# EAGLE design RobotBoard_v2.0 (EAGLE 6.1)
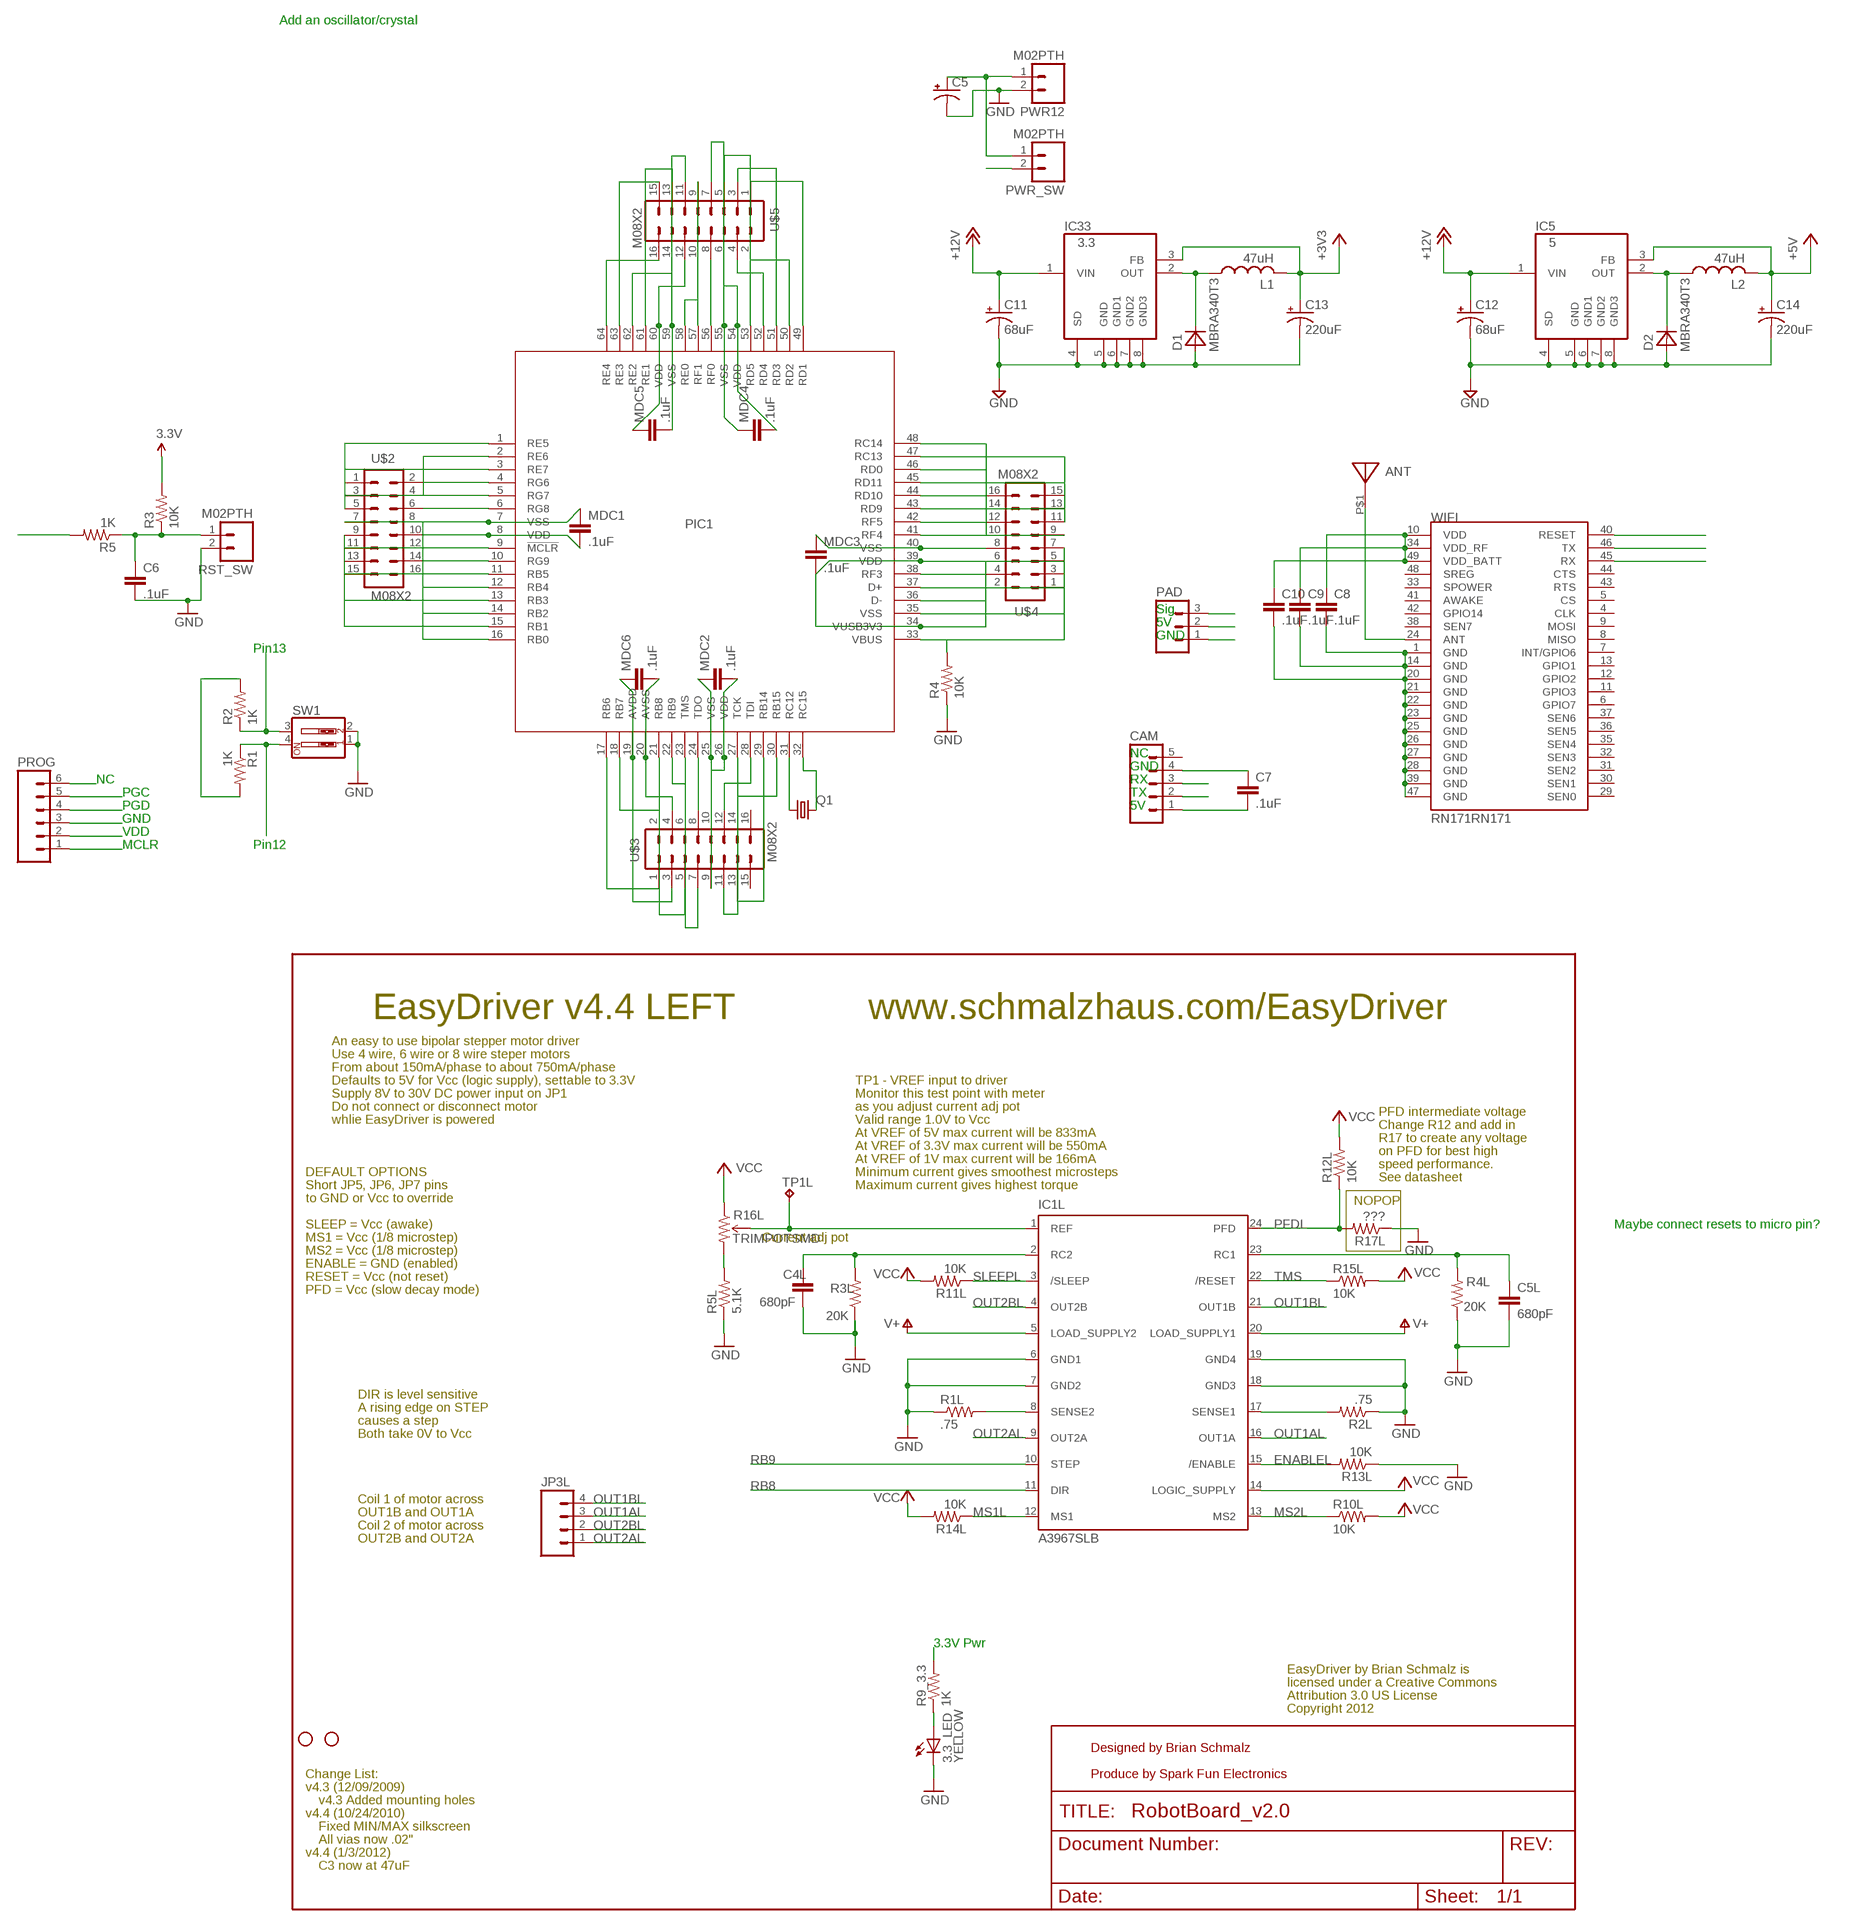
[diagram p0: schematic, sheet 1, part 1 of 2]
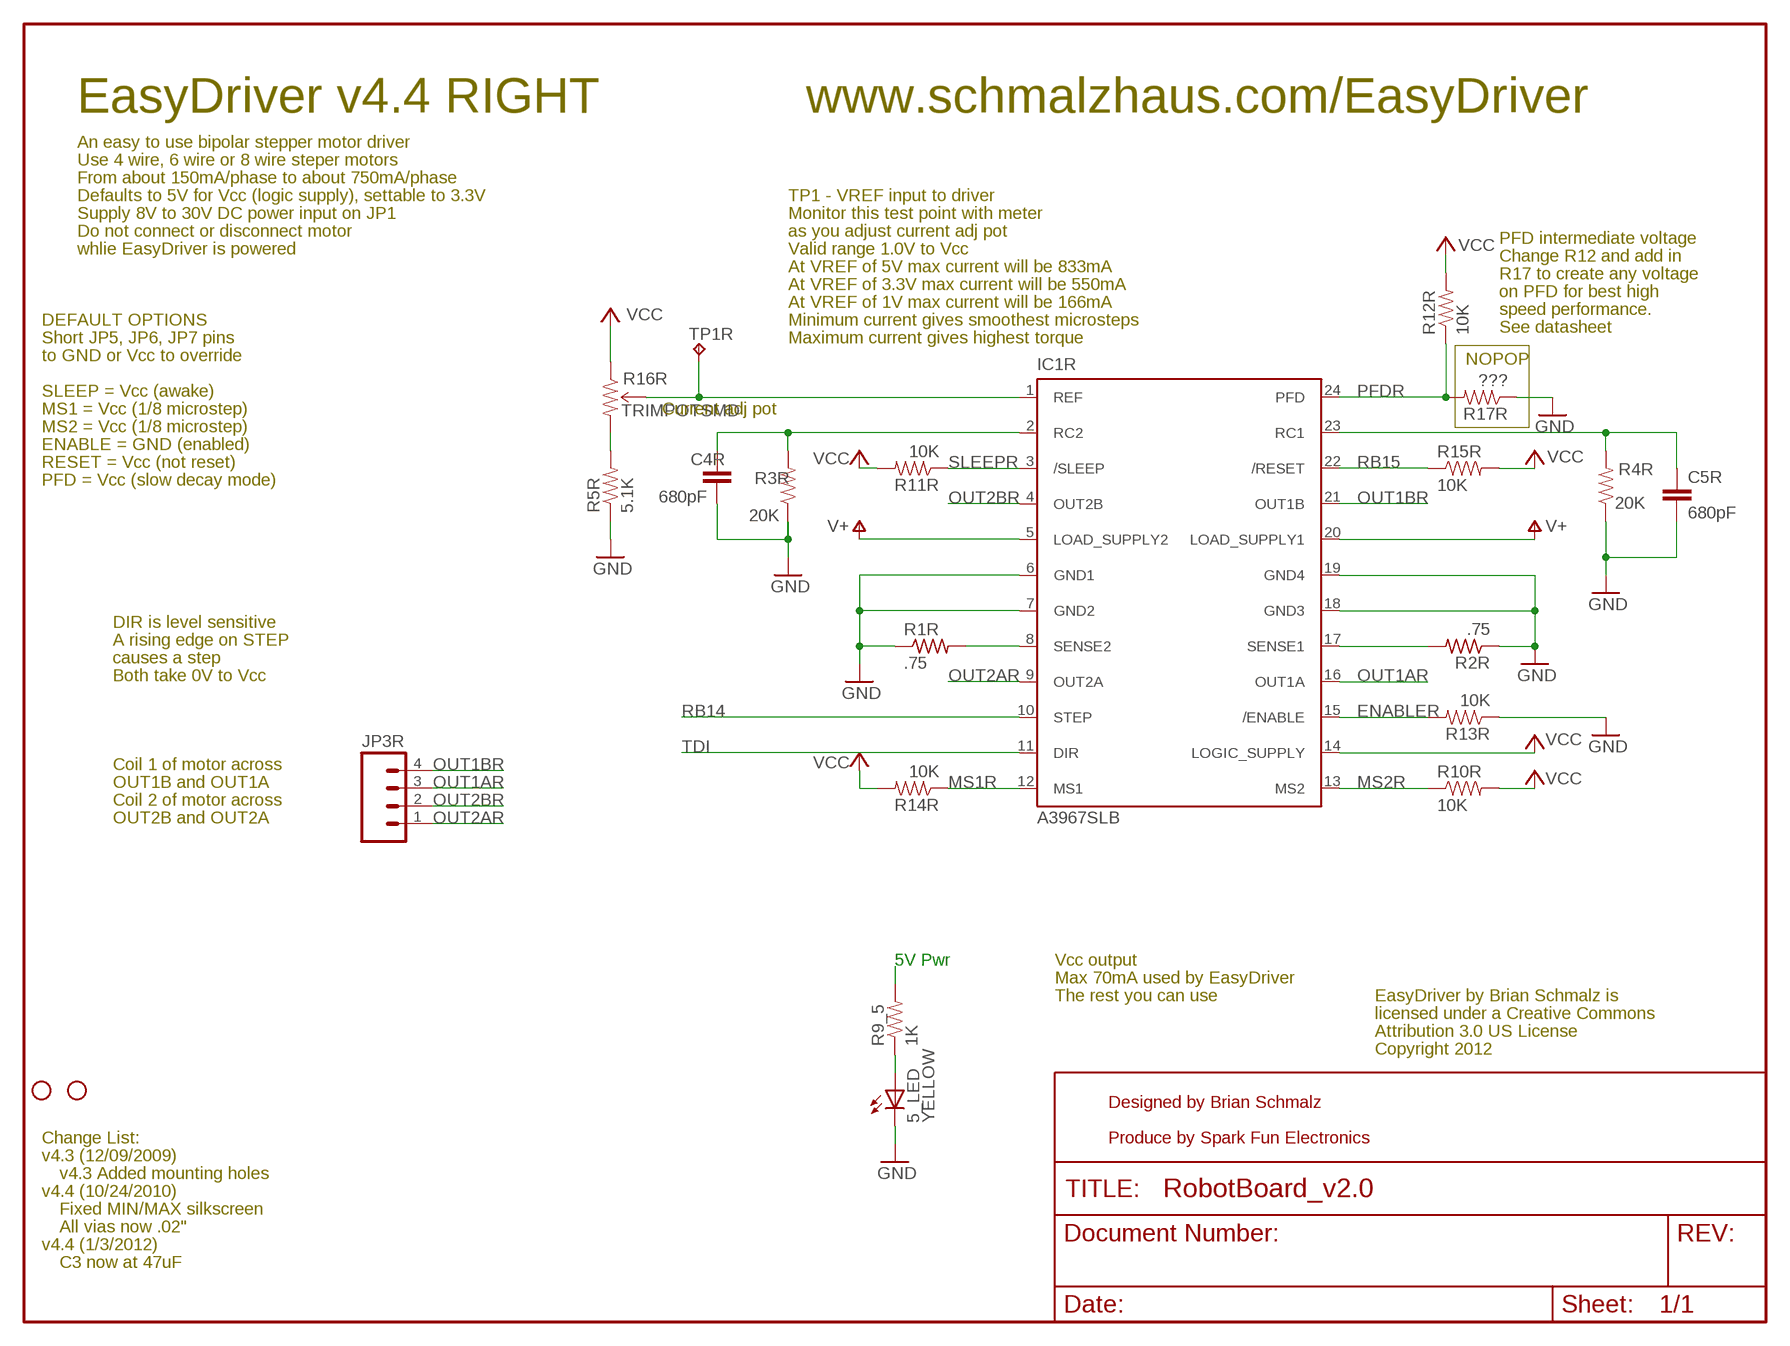
[diagram p1: schematic, sheet 1, part 2 of 2]

## Parts
3.3_LED  YELLOW  LED0603  [LED-0603]
5_LED  YELLOW  LED0603  [LED-0603]
ANT  2450AT18A100  [2450AT18A100]
C4L  680pF  CAP0402  [C0402]
C4R  680pF  CAP0402  [C0402]
C5  CAP_POLPTH4  [CPOL-RADIAL-1000UF-25V]
C5L  680pF  CAP0402  [C0402]
C5R  680pF  CAP0402  [C0402]
C6  .1uF  CAP0603  [0603]
C7  .1uF  CAP0603  [0603]
C8  .1uF  CAP0603  [0603]
C9  .1uF  CAP0603  [0603]
C10  .1uF  CAP0603  [0603]
C11  68uF  CPOL-USD  [PANASONIC_D]
C12  68uF  CPOL-USD  [PANASONIC_D]
C13  220uF  CPOL-USD  [PANASONIC_D]
C14  220uF  CPOL-USD  [PANASONIC_D]
CAM  M05LOCK  [1X05_LOCK]
D1  MBRA340T3  [SMA]
D2  MBRA340T3  [SMA]
IC1L  A3967SLB  [SO24W]
IC1R  A3967SLB  [SO24W]
IC5  5  AP1509  [SO08]
IC33  3.3  AP1509  [SO08]
JP1  STAND-OFF  [STAND-OFF]
JP2  STAND-OFF  [STAND-OFF]
JP3L  M041X04_NO_SILK  [1X04_NO_SILK]
JP3R  M041X04_NO_SILK  [1X04_NO_SILK]
JP8  STAND-OFF  [STAND-OFF]
JP9  STAND-OFF  [STAND-OFF]
L1  47uH  L-US6000-XXX-RC  [6000-XXXX-RC]
L2  47uH  L-US6000-XXX-RC  [6000-XXXX-RC]
MDC1  .1uF  CAP0603  [0603]
MDC2  .1uF  CAP0603  [0603]
MDC3  .1uF  CAP0603  [0603]
MDC4  .1uF  CAP0603  [0603]
MDC5  .1uF  CAP0603  [0603]
MDC6  .1uF  CAP0603  [0603]
PAD  M03POLAR  [MOLEX-1X3]
PIC1  PIC32MZ2048ECM064  [TQFP64-10X10X1MM]
PROG  M06LOCK  [1X06_LOCK]
PWR12  M02PTH  [1X02]
PWR_SW  M02PTH  [1X02]
Q1  CRYSTALHC49UP  [HC49UP]
R1  1K  RESISTOR0402  [C0402]
R1L  .75  R-US_R0805  [R0805]
R1R  .75  R-US_R0805  [R0805]
R2  1K  RESISTOR0402  [C0402]
R2L  .75  R-US_R0805  [R0805]
R2R  .75  R-US_R0805  [R0805]
R3  10K  RESISTOR0402  [C0402]
R3L  20K  RESISTOR0402  [C0402]
R3R  20K  RESISTOR0402  [C0402]
R4  10K  RESISTOR0402  [C0402]
R4L  20K  RESISTOR0402  [C0402]
R4R  20K  RESISTOR0402  [C0402]
R5  1K  RESISTOR0402  [C0402]
R5L  5.1K  RESISTOR0402  [C0402]
R5R  5.1K  RESISTOR0402  [C0402]
R9_3.3  1K  RESISTOR0402  [C0402]
R9_5  1K  RESISTOR0402  [C0402]
R10L  10K  RESISTOR0402  [C0402]
R10R  10K  RESISTOR0402  [C0402]
R11L  10K  RESISTOR0402  [C0402]
R11R  10K  RESISTOR0402  [C0402]
R12L  10K  RESISTOR0402  [C0402]
R12R  10K  RESISTOR0402  [C0402]
R13L  10K  RESISTOR0402  [C0402]
R13R  10K  RESISTOR0402  [C0402]
R14L  10K  RESISTOR0402  [C0402]
R14R  10K  RESISTOR0402  [C0402]
R15L  10K  RESISTOR0402  [C0402]
R15R  10K  RESISTOR0402  [C0402]
R16L  TRIMPOTSMD  [TRIMPOT-3MM]
R16R  TRIMPOTSMD  [TRIMPOT-3MM]
R17L  ???  RESISTOR0402  [C0402]
R17R  ???  RESISTOR0402  [C0402]
RST_SW  M02PTH  [1X02]
SW1  SW_DIP-2  [DIPSWITCH-02]
TP1L  TPPAD1-13  [P1-13]
TP1R  TPPAD1-13  [P1-13]
U$2  M08X2  [2X8]
U$3  M08X2  [2X8]
U$4  M08X2  [2X8]
U$5  M08X2  [2X8]
WIFI  RN171RN171  [RN171]

## Nets
3.3V: C8.1 C9.1 C10.1 C13.+ IC1L.14(LOGIC_SUPPLY) IC1R.14(LOGIC_SUPPLY) IC33.3(FB) L1.2 MDC1.2 MDC2.2 MDC3.2 MDC4.2 MDC5.1 MDC6.1 PIC1.8(VDD) PIC1.19(AVDD) PIC1.26(VDD) PIC1.34(VUSB3V3) PIC1.39(VDD) PIC1.54(VDD) PIC1.60(VDD) PROG.2 R1.2 R2.2 R3.2 R9_3.3.2 R10L.2 R10R.2 R11L.2 R11R.2 R12L.2 R12R.2 R14L.2 R14R.2 R15L.2 R15R.2 R16L.1(CCW) R16R.1(CCW) U$2.8 U$3.3 U$3.10 U$4.2 U$4.7 U$5.6 U$5.12 WIFI.10(VDD) WIFI.34(VDD_RF) WIFI.49(VDD_BATT) ; supply symbol labelled VCC, +3V3
5V: C7.2 C14.+ CAM.1 IC5.3(FB) L2.2 PAD.2 R9_5.2 ; supply symbol labelled +5V
12V: C11.+ C12.+ IC1L.5(LOAD_SUPPLY2) IC1L.20(LOAD_SUPPLY1) IC1R.5(LOAD_SUPPLY2) IC1R.20(LOAD_SUPPLY1) IC5.1(VIN) IC33.1(VIN) PWR_SW.2 ; supply symbol labelled V+, +12V
!MCLR: PIC1.9(!MCLR) PROG.1 R5.2 U$2.9
A44: C6.1 R3.1 R5.1 RST_SW.1
D+: PIC1.37(D+) U$4.5
D-: PIC1.36(D-) U$4.4
ENABLEL: IC1L.15(/ENABLE) R13L.2
ENABLER: IC1R.15(/ENABLE) R13R.2
GND: 3.3_LED.C 5_LED.C C4L.2 C4R.2 C5.2(-) C5L.2 C5R.2 C6.2 C7.1 C8.2 C9.2 C10.2 C11.- C12.- C13.- C14.- CAM.4 D1.A D2.A IC1L.6(GND1) IC1L.7(GND2) IC1L.18(GND3) IC1L.19(GND4) IC1R.6(GND1) IC1R.7(GND2) IC1R.18(GND3) IC1R.19(GND4) IC5.4(SD) IC5.5(GND) IC5.6(GND1) IC5.7(GND2) IC5.8(GND3) IC33.4(SD) IC33.5(GND) IC33.6(GND1) IC33.7(GND2) IC33.8(GND3) MDC1.1 MDC2.1 MDC3.1 MDC4.1 MDC5.2 MDC6.2 PAD.1 PIC1.7(VSS) PIC1.20(AVSS) PIC1.25(VSS) PIC1.35(VSS) PIC1.40(VSS) PIC1.55(VSS) PIC1.59(VSS) PROG.3 PWR12.2 R1L.1 R1R.1 R2L.1 R2R.1 R3L.1 R3R.1 R4.1 R4L.1 R4R.1 R5L.1 R5R.1 R13L.1 R13R.1 R17L.1 R17R.1 RST_SW.2 SW1.1 SW1.2 U$2.7 U$3.4 U$3.9 U$4.3 U$4.8 U$5.7 U$5.11 WIFI.1(GND) WIFI.14(GND) WIFI.20(GND) WIFI.21(GND) WIFI.22(GND) WIFI.23(GND) WIFI.25(GND) WIFI.26(GND) WIFI.27(GND) WIFI.28(GND) WIFI.39(GND) WIFI.47(GND)
MS1L: IC1L.12(MS1) R14L.1
MS1R: IC1R.12(MS1) R14R.1
MS2L: IC1L.13(MS2) R10L.1
MS2R: IC1R.13(MS2) R10R.1
N$1: IC1L.8(SENSE2) R1L.2
N$2: 3.3_LED.A R9_3.3.1
N$3: IC1L.17(SENSE1) R2L.2
N$5: C4L.1 IC1L.2(RC2) R3L.2
N$6: PIC1.31(RC12) Q1.1
N$7: C5L.1 IC1L.23(RC1) R4L.2
N$8: IC1R.8(SENSE2) R1R.2
N$9: IC1R.17(SENSE1) R2R.2
N$10: C4R.1 IC1R.2(RC2) R3R.2
N$11: R5L.2 R16L.3(CW)
N$12: IC1L.1(REF) R16L.2(WIPER) TP1L.1(TP)
N$13: C5R.1 IC1R.23(RC1) R4R.2
N$14: IC1R.1(REF) R16R.2(WIPER) TP1R.1(TP)
N$15: PIC1.32(RC15) Q1.2
N$16: R5R.2 R16R.3(CW)
N$17: 5_LED.A R9_5.1
N$18: ANT.P$1 WIFI.24(ANT)
N$19: C5.1(+) PWR12.1 PWR_SW.1
N$34: PROG.6
N$40: D1.C IC33.2(OUT) L1.1
N$45: D2.C IC5.2(OUT) L2.1
OUT1AL: IC1L.16(OUT1A) JP3L.3
OUT1AR: IC1R.16(OUT1A) JP3R.3
OUT1BL: IC1L.21(OUT1B) JP3L.4
OUT1BR: IC1R.21(OUT1B) JP3R.4
OUT2AL: IC1L.9(OUT2A) JP3L.1
OUT2AR: IC1R.9(OUT2A) JP3R.1
OUT2BL: IC1L.4(OUT2B) JP3L.2
OUT2BR: IC1R.4(OUT2B) JP3R.2
PFDL: IC1L.24(PFD) R12L.1 R17L.2
PFDR: IC1R.24(PFD) R12R.1 R17R.2
RB0: PIC1.16(RB0) PROG.4 U$2.16
RB1: PIC1.15(RB1) PROG.5 U$2.15
RB2: PIC1.14(RB2) U$2.14
RB3: PIC1.13(RB3) R2.1 SW1.3 U$2.13
RB4: PIC1.12(RB4) R1.1 SW1.4 U$2.12
RB5: PIC1.11(RB5) U$2.11
RB6: PIC1.17(RB6) U$3.1
RB7: PIC1.18(RB7) U$3.2
RB8: IC1L.11(DIR) PIC1.21(RB8) U$3.5
RB9: IC1L.10(STEP) PIC1.22(RB9) U$3.6
RB14: IC1R.10(STEP) PIC1.29(RB14) U$3.13
RB15: IC1R.22(/RESET) PIC1.30(RB15) R15R.1 U$3.14
RC13: PIC1.47(RC13) U$4.15
RC14: PIC1.48(RC14) U$4.16
RD0: CAM.3 PIC1.46(RD0) U$4.14
RD1: PIC1.49(RD1) U$5.1
RD2: PIC1.50(RD2) U$5.2
RD3: PIC1.51(RD3) U$5.3
RD4: PIC1.52(RD4) U$5.4
RD5: PIC1.53(RD5) U$5.5
RD9: CAM.2 PIC1.43(RD9) U$4.11
RD10: PIC1.44(RD10) U$4.12
RD11: PIC1.45(RD11) U$4.13
RE0: PIC1.58(RE0) U$5.10
RE1: PIC1.61(RE1) U$5.13
RE2: PIC1.62(RE2) U$5.14
RE3: PIC1.63(RE3) U$5.15
RE4: PIC1.64(RE4) U$5.16
RE5: PIC1.1(RE5) U$2.1
RE6: PIC1.2(RE6) U$2.2
RE7: PIC1.3(RE7) U$2.3
RF0: PIC1.56(RF0) U$5.8
RF1: PIC1.57(RF1) U$5.9
RF3: PAD.3 PIC1.38(RF3) U$4.6
RF4: PIC1.41(RF4) U$4.9
RF5: PIC1.42(RF5) U$4.10
RG6: PIC1.4(RG6) U$2.4 WIFI.40(RESET)
RG7: PIC1.5(RG7) U$2.5 WIFI.45(RX)
RG8: PIC1.6(RG8) U$2.6 WIFI.46(TX)
RG9: PIC1.10(RG9) U$2.10
SLEEPL: IC1L.3(/SLEEP) R11L.1
SLEEPR: IC1R.3(/SLEEP) R11R.1
TCK: PIC1.27(TCK) U$3.11
TDD: PIC1.24(TDO) U$3.8
TDI: IC1R.11(DIR) PIC1.28(TDI) U$3.12
TMS: IC1L.22(/RESET) PIC1.23(TMS) R15L.1 U$3.7
VBUS: PIC1.33(VBUS) R4.2 U$4.1
Unconnected: CAM.5 U$3.15 U$3.16 WIFI.4(CLK) WIFI.5(CS) WIFI.6(GPIO7) WIFI.7(INT/GPIO6) WIFI.8(MISO) WIFI.9(MOSI) WIFI.11(GPIO3) WIFI.12(GPIO2) WIFI.13(GPIO1) WIFI.29(SEN0) WIFI.30(SEN1) WIFI.31(SEN2) WIFI.32(SEN3) WIFI.33(SPOWER) WIFI.35(SEN4) WIFI.36(SEN5) WIFI.37(SEN6) WIFI.38(SEN7) WIFI.41(AWAKE) WIFI.42(GPIO14) WIFI.43(RTS) WIFI.44(CTS) WIFI.48(SREG)

## Notes on the sheet
- Add an oscillator/crystal
- Sig
- 5V
- GND
- Pin13
- NC
- GND
- NC | RX
- PGC | TX
- PGD | 5V
- GND
- VDD
- MCLR | Pin12
- EasyDriver v4.4 LEFT | www.schmalzhaus.com/EasyDriver
- An easy to use bipolar stepper motor driver
- Use 4 wire, 6 wire or 8 wire steper motors
- From about 150mA/phase to about 750mA/phase
- Defaults to 5V for Vcc (logic supply), settable to 3.3V | TP1 - VREF input to driver
- Supply 8V to 30V DC power input on JP1 | Monitor this test point with meter
- Do not connect or disconnect motor | as you adjust current adj pot
- PFD intermediate voltage
- whlie EasyDriver is powered | Valid range 1.0V to Vcc
- Change R12 and add in
- At VREF of 5V max current will be 833mA
- R17 to create any voltage
- At VREF of 3.3V max current will be 550mA
- on PFD for best high
- At VREF of 1V max current will be 166mA
- speed performance.
- DEFAULT OPTIONS | Minimum current gives smoothest microsteps
- See datasheet
- Short JP5, JP6, JP7 pins | Maximum current gives highest torque
- to GND or Vcc to override | NOPOP
- SLEEP = Vcc (awake) | Maybe connect resets to micro pin?
- MS1 = Vcc (1/8 microstep) | Current adj pot
- MS2 = Vcc (1/8 microstep)
- ENABLE = GND (enabled)
- RESET = Vcc (not reset)
- PFD = Vcc (slow decay mode)
- DIR is level sensitive
- A rising edge on STEP
- causes a step
- Both take 0V to Vcc
- Coil 1 of motor across
- OUT1B and OUT1A
- Coil 2 of motor across
- OUT2B and OUT2A
- 3.3V Pwr
- EasyDriver by Brian Schmalz is
- licensed under a Creative Commons
- Attribution 3.0 US License
- Copyright 2012
- Designed by Brian Schmalz
- Change List: | Produce by Spark Fun Electronics
- v4.3 (12/09/2009)
- v4.3 Added mounting holes
- v4.4 (10/24/2010)
- Fixed MIN/MAX silkscreen
- All vias now .02"
- v4.4 (1/3/2012)
- C3 now at 47uF
- EasyDriver v4.4 RIGHT | www.schmalzhaus.com/EasyDriver
- An easy to use bipolar stepper motor driver
- Use 4 wire, 6 wire or 8 wire steper motors
- From about 150mA/phase to about 750mA/phase
- Defaults to 5V for Vcc (logic supply), settable to 3.3V | TP1 - VREF input to driver
- Supply 8V to 30V DC power input on JP1 | Monitor this test point with meter
- Do not connect or disconnect motor | as you adjust current adj pot
- PFD intermediate voltage
- whlie EasyDriver is powered | Valid range 1.0V to Vcc
- Change R12 and add in
- At VREF of 5V max current will be 833mA
- R17 to create any voltage
- At VREF of 3.3V max current will be 550mA
- on PFD for best high
- At VREF of 1V max current will be 166mA
- speed performance.
- DEFAULT OPTIONS | Minimum current gives smoothest microsteps
- See datasheet
- Short JP5, JP6, JP7 pins | Maximum current gives highest torque
- to GND or Vcc to override | NOPOP
- SLEEP = Vcc (awake)
- MS1 = Vcc (1/8 microstep) | Current adj pot
- MS2 = Vcc (1/8 microstep)
- ENABLE = GND (enabled)
- RESET = Vcc (not reset)
- PFD = Vcc (slow decay mode)
- DIR is level sensitive
- A rising edge on STEP
- causes a step
- Both take 0V to Vcc
- Coil 1 of motor across
- OUT1B and OUT1A
- Coil 2 of motor across
- OUT2B and OUT2A
- 5V Pwr | Vcc output
- Max 70mA used by EasyDriver
- The rest you can use | EasyDriver by Brian Schmalz is
- licensed under a Creative Commons
- Attribution 3.0 US License
- Copyright 2012
- Designed by Brian Schmalz
- Change List: | Produce by Spark Fun Electronics
- v4.3 (12/09/2009)
- v4.3 Added mounting holes
- v4.4 (10/24/2010)
- Fixed MIN/MAX silkscreen
- All vias now .02"
- v4.4 (1/3/2012)
- C3 now at 47uF

## Library data of the parts
3.3_LED 5_LED = SparkFun03_30_09:LED: LEDs Standard schematic elements and footprints for 5mm, 3mm, 1206, and 0603 sized LEDs. 5mm - Spark Fun Electronics SKU : COM-00529 (and others)
ANT = Johanson_antenna:2450AT18A100
C4L C4R C5L C5R = SparkFun03_30_09:CAP: Capacitor Standard 0603 ceramic capacitor, and 0.1" leaded capacitor.
C5 = SparkFun-Capacitors:CAP_POL: Capacitor Polarized These are standard SMD and PTH capacitors. Normally 10uF, 47uF, and 100uF in electrolytic and tantalum varieties. Always verify the external diameter of the through hole cap, it varies with capacity, voltage, and manufacturer. The EIA devices should be standard.
C6-C10 MDC1-MDC6 = SparkFun-2-11-09:CAP: Capacitor Standard 0603 ceramic capacitor, and 0.1" leaded capacitor.
C11-C14 = rcl:CPOL-US: POLARIZED CAPACITOR, American symbol
CAM = SparkFun-Connectors:M05: Header 5 Standard 5-pin 0.1" header. Use with straight break away headers (SKU : PRT-00116), right angle break away headers (PRT-00553), swiss pins (PRT-00743), machine pins (PRT-00117), and female headers (PRT-00115). Molex polarized connector foot print use with SKU : PRT-08230 with associated crimp pins and housings.
D1 D2 = diode:MBRA340T3: Surface Mount Schottky Power Rectifier Source: http://www.onsemi.com/pub_link/Collateral/MBRA340T3-D.PDF
IC1L IC1R = Allegro:A3967SLB: ANALOG DEVICES
IC5 IC33 = crw:AP1509: 150KHz, 2A PWM BUCK DC/DC CONVERTER; OC_FARNELL: unknown; OC_NEWARK: unknown
JP1 JP2 JP8 JP9 = SparkFun-7-28-09:STAND-OFF: Stand Off This is the mechanical footprint for a #4 phillips button head screw. Use the keepout ring to avoid running the screw head into surrounding components. SKU : PRT-00447
JP3L JP3R = SparkFun:M04: Header 4 Standard 4-pin 0.1" header. Use with straight break away headers (SKU : PRT-00116), right angle break away headers (PRT-00553), swiss pins (PRT-00743), machine pins (PRT-00117), and female headers (PRT-00115). Molex polarized connector foot print use with SKU : PRT-08231 with associated crimp pins and housings.
L1 L2 = rcl:L-US: INDUCTOR, American symbol
PAD = SparkFun-Connectors:M03: Header 3 Standard 3-pin 0.1" header. Use with straight break away headers (SKU : PRT-00116), right angle break away headers (PRT-00553), swiss pins (PRT-00743), machine pins (PRT-00117), and female headers (PRT-00115). Molex polarized connector foot print use with SKU : PRT-08232 with associated crimp pins and housings.
PIC1 = microchip:PIC32MZ2048ECM064: PIC32MZ2048ECM064 Microchip microcontroller TQFP64 10x10x1
PROG = SparkFun-Connectors:M06: Header 6 Standard 6-pin 0.1" header. Use with straight break away headers (SKU : PRT-00116), right angle break away headers (PRT-00553), swiss pins (PRT-00743), machine pins (PRT-00117), and female headers (PRT-00115). Molex polarized connector foot print use with SKU : PRT-08094 with associated crimp pins and housings. NOTES ON THE VARIANTS LOCK and LOCK_LONGPADS... This footprint was designed to help hold the alignment of a through-hole component (i.e. 6-pin header) while soldering it into place. You may notice that each hole has been shifted either up or down by 0.005 of an inch from it's more standard position (which is a perfectly straight line). This slight alteration caused the pins (the squares in the middle) to touch the edges of the holes. Because they are alternating, it causes a "brace" to hold the component in place. 0.005 has proven to be the perfect amount of "off-center" position when using our standard breakaway headers. Although looks a little odd when you look at the bare footprint, once you have a header in there, the alteration is very hard to notice. Also,if you push a header all the way into place, it is covered up entirely on the bottom side. This idea of altering the position of holes to aid alignment will be further integrated into the Sparkfun Library for other footprints. It can help hold any component with 3 or more connection pins.
PWR12 PWR_SW RST_SW = SparkFun-Connectors:M02: Standard 2-pin 0.1" header. Use with - straight break away headers ( PRT-00116) - right angle break away headers (PRT-00553) - swiss pins (PRT-00743) - machine pins (PRT-00117) - female headers (PRT-00115) Molex polarized connector foot print use with: PRT-08233 with associated crimp pins and housings. 2.54_SCREWTERM for use with PRT-10571. 3.5mm Screw Terminal footprints for PRT-08084 5mm Screw Terminal footprints for use with PRT-08433
Q1 = crystal:CRYSTAL: CRYSTAL; OC_FARNELL: unknown; OC_NEWARK: unknown
R1-R3 R3L R3R R4 R4L R4R R5 R5L R5R R9_3.3 R9_5 R10L R10R R11L R11R R12L R12R R13L R13R R14L R14R R15L R15R R17L R17R = SparkFun03_30_09:RESISTOR: Resistor Basic schematic elements and footprints for 0603, 1206, and PTH 1/10th watt (small) resistors.
R1L R1R R2L R2R = rcl:R-US_: RESISTOR, American symbol
R16L R16R = SparkFun:TRIMPOT
SW1 = SparkFun-Electromechanical:SW_DIP-2: DIP SWITCH
TP1L TP1R = testpad:TP
U$2-U$5 = SparkFun-Connectors:M08X2: .1" headers, two rows of 8 each
WIFI = SparkFun-RF:RN171: WiFi Module

## Board
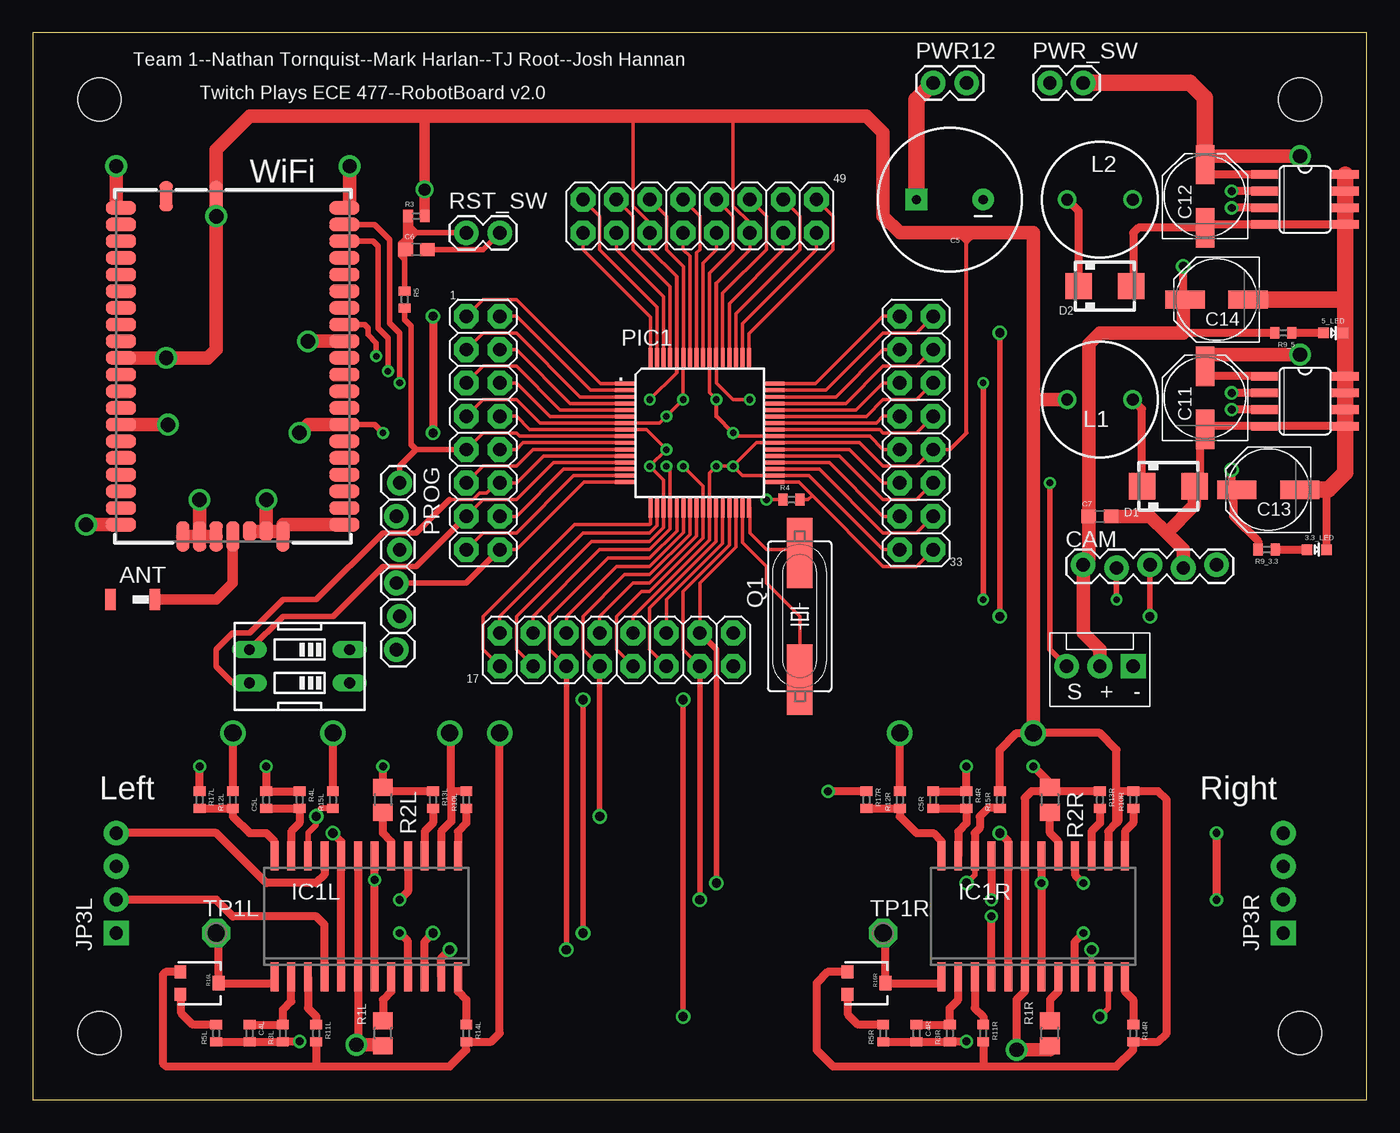
[diagram p2: board, top side]
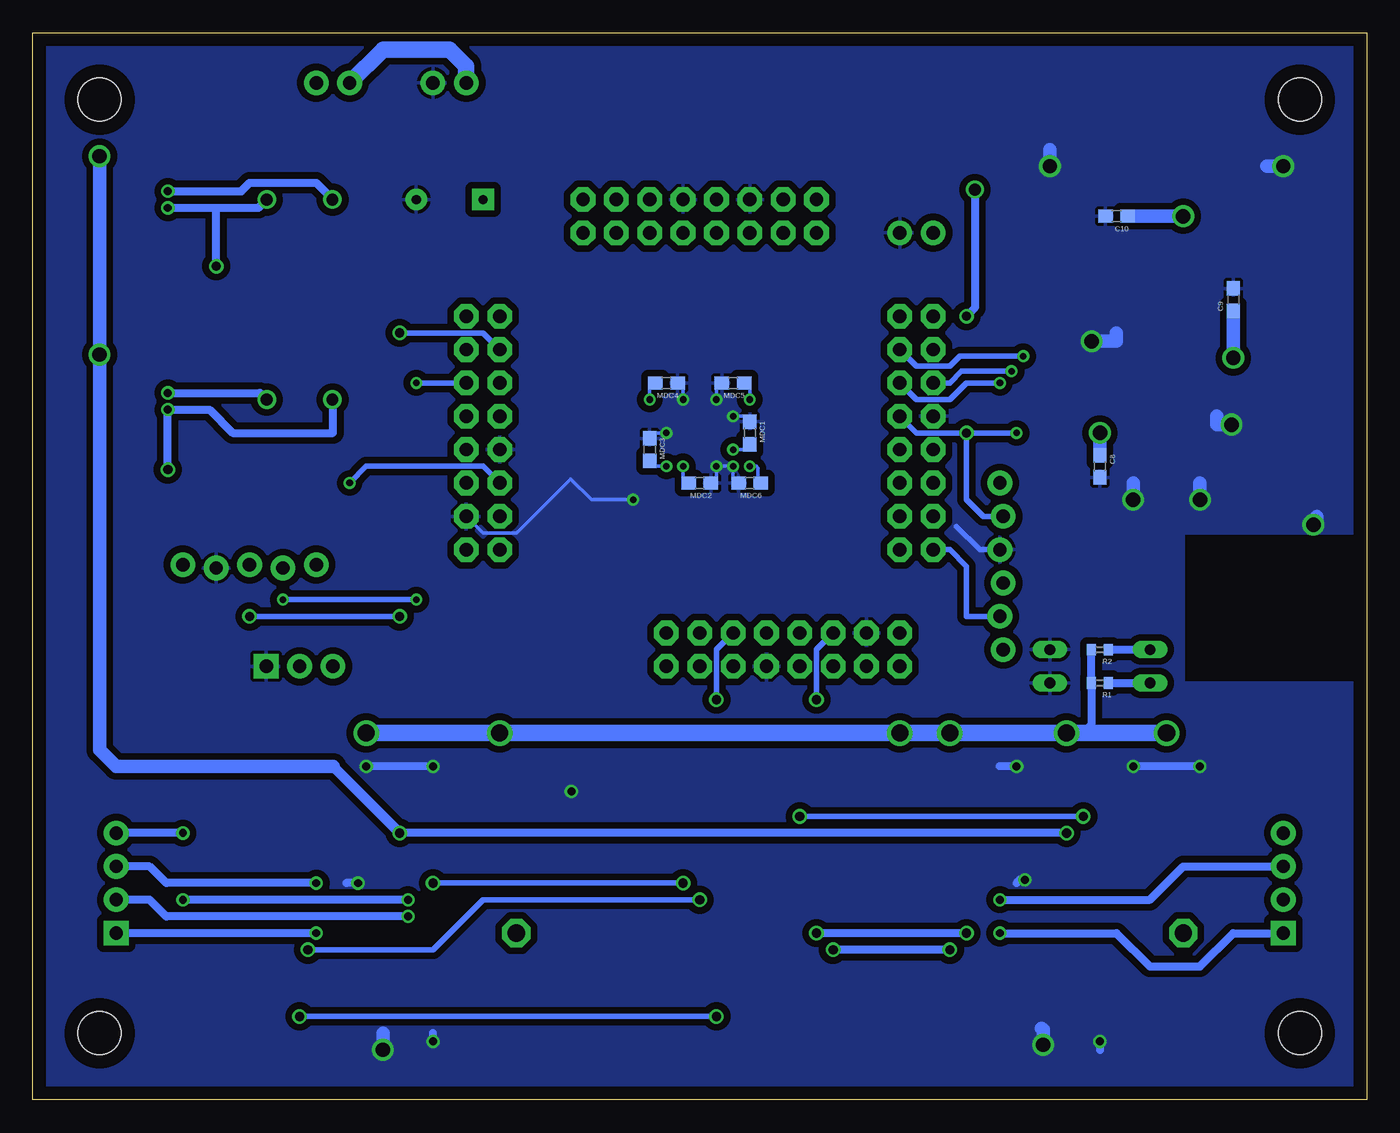
[diagram p3: board, bottom side, seen from below]

Size 101.6 x 81.28 mm. Coordinates in mm from the lower left corner, seen from the top.
Outline: 0,0 101.6,0 101.6,81.28 0,81.28 0,0
Copper layers (1*16): Top 0.035mm / dielectric 1.5mm / Bottom 0.035mm
Design rules: minimum track width 10mil, minimum drill 24mil, track to track 8mil, track to pad 8mil, pad to pad 8mil, via to via 8mil, smd to smd 8mil, copper to edge 40mil, drill to drill 8mil, minimum pad ring 10mil, minimum via ring 8mil, stop-mask expansion 4mil, vias tented up to drill 0mil, thermal gap 10mil
tKeepout: area 0,33 to 12.7,41.9
bKeepout: area 0,31.8 to 14,43.2

### Footprints (pad centres in the part's own frame; a part is rotated, then mirrored left to right if it is on the bottom)
LED-0603 = smd 0.8 x 0.8: A 0,-0.75; C 0,0.75
2450AT18A100 = smd 0.8 x 1.6: P$1 -1.7,0; P$2 1.7,0
C0402 = smd 0.7 x 0.9: 1 -0.65,0; 2 0.65,0
CPOL-RADIAL-1000UF-25V = drill 0.7 pad 1.651 square: 1 2.54,0 | drill 0.7 pad 1.651: 2 -2.54,0
0603 = smd 1.1 x 1: 1 -0.85,0; 2 0.85,0
PANASONIC_D = smd 3 x 1.4: + 2.4,0; - -2.4,0
1X05_LOCK = drill 1.016 pad 1.88: 1 0,0.127; 2 2.54,-0.127; 3 5.08,0.127; 4 7.62,-0.127; 5 10.16,0.127
SMA = smd 2 x 2: A 2,0; C -2,0
SO24W = smd 0.6 x 2.2: 1 -6.985,-4.6; 2 -5.715,-4.6; 3 -4.445,-4.6; 4 -3.175,-4.6; 5 -1.905,-4.6; 6 -0.635,-4.6; 7 0.635,-4.6; 8 1.905,-4.6; 9 3.175,-4.6; 10 4.445,-4.6; 11 5.715,-4.6; 12 6.985,-4.6; 13 6.985,4.6; 14 5.715,4.6; 15 4.445,4.6; 16 3.175,4.6; 17 1.905,4.6; 18 0.635,4.6; 19 -0.635,4.6; 20 -1.905,4.6; 21 -3.175,4.6; 22 -4.445,4.6; 23 -5.715,4.6; 24 -6.985,4.6
SO08 = smd 0.66 x 2.032: 1 -1.905,-3.073; 2 -0.635,-3.073; 3 0.635,-3.073; 4 1.905,-3.073; 5 1.905,3.073; 6 0.635,3.073; 7 -0.635,3.073; 8 -1.905,3.073
STAND-OFF = hole 3.302: 0,0
1X04_NO_SILK = drill 1.016 pad 1.88 square: 1 0,0 | drill 1.016 pad 1.88: 2 2.54,0; 3 5.08,0; 4 7.62,0
6000-XXXX-RC = drill 0.9 pad 1.422: 1 -2.5,0; 2 2.5,0
MOLEX-1X3 = drill 1.016 pad 1.88 square: 1 0,0 | drill 1.016 pad 1.88: 2 2.54,0; 3 5.08,0
TQFP64-10X10X1MM = smd 1.5 x 0.3: 1 -5.7,3.75; 2 -5.7,3.25; 3 -5.7,2.75; 4 -5.7,2.25; 5 -5.7,1.75; 6 -5.7,1.25; 7 -5.7,0.75; 8 -5.7,0.25; 9 -5.7,-0.25; 10 -5.7,-0.75; 11 -5.7,-1.25; 12 -5.7,-1.75; 13 -5.7,-2.25; 14 -5.7,-2.75; 15 -5.7,-3.25; 16 -5.7,-3.75; 33 5.7,-3.75; 34 5.7,-3.25; 35 5.7,-2.75; 36 5.7,-2.25; 37 5.7,-1.75; 38 5.7,-1.25; 39 5.7,-0.75; 40 5.7,-0.25; 41 5.7,0.25; 42 5.7,0.75; 43 5.7,1.25; 44 5.7,1.75; 45 5.7,2.25; 46 5.7,2.75; 47 5.7,3.25; 48 5.7,3.75 | smd 0.3 x 1.5: 17 -3.75,-5.7; 18 -3.25,-5.7; 19 -2.75,-5.7; 20 -2.25,-5.7; 21 -1.75,-5.7; 22 -1.25,-5.7; 23 -0.75,-5.7; 24 -0.25,-5.7; 25 0.25,-5.7; 26 0.75,-5.7; 27 1.25,-5.7; 28 1.75,-5.7; 29 2.25,-5.7; 30 2.75,-5.7; 31 3.25,-5.7; 32 3.75,-5.7; 49 3.75,5.7; 50 3.25,5.7; 51 2.75,5.7; 52 2.25,5.7; 53 1.75,5.7; 54 1.25,5.7; 55 0.75,5.7; 56 0.25,5.7; 57 -0.25,5.7; 58 -0.75,5.7; 59 -1.25,5.7; 60 -1.75,5.7; 61 -2.25,5.7; 62 -2.75,5.7; 63 -3.25,5.7; 64 -3.75,5.7
1X06_LOCK = drill 1.016 pad 1.88: 1 0,0; 2 2.54,-0.254; 3 5.08,0; 4 7.62,-0.254; 5 10.16,0; 6 12.7,-0.254
1X02 = drill 1.016 pad 1.88: 1 0,0; 2 2.54,0
HC49UP = smd 5.334 x 1.93: 1 -4.826,0; 2 4.826,0
R0805 = smd 1.3 x 1.5: 1 -0.95,0; 2 0.95,0
TRIMPOT-3MM = smd 1 x 0.9: 1 -0.85,-1.45; 3 0.85,-1.45 | smd 1.1 x 0.9: 2 0,1.45
DIPSWITCH-02 = drill 0.813 long: 1 -1.27,-3.81; 2 1.27,-3.81; 3 1.27,3.81; 4 -1.27,3.81
P1-13 = drill 1.321 pad 2.159 octagon: 1 0,0
2X8 = drill 1.016 pad 1.88 octagon: 1 0,0; 2 0,2.54; 3 2.54,0; 4 2.54,2.54; 5 5.08,0; 6 5.08,2.54; 7 7.62,0; 8 7.62,2.54; 9 10.16,0; 10 10.16,2.54; 11 12.7,0; 12 12.7,2.54; 13 15.24,0; 14 15.24,2.54; 15 17.78,0; 16 17.78,2.54
RN171 = smd 1.016 x 2.286: 1 12.065,8.509; 2 10.795,8.509; 3 9.525,8.509; 4 8.255,8.509; 5 6.985,8.509; 6 5.715,8.509; 7 4.445,8.509; 8 3.175,8.509; 9 1.905,8.509; 10 0.635,8.509; 11 -0.635,8.509; 12 -1.905,8.509; 13 -3.175,8.509; 14 -4.445,8.509; 15 -5.715,8.509; 16 -6.985,8.509; 17 -8.255,8.509; 18 -9.525,8.509; 19 -10.795,8.509; 20 -12.065,8.509; 28 -12.065,-8.509; 29 -10.795,-8.509; 30 -9.525,-8.509; 31 -8.255,-8.509; 32 -6.985,-8.509; 33 -5.715,-8.509; 34 -4.445,-8.509; 35 -3.175,-8.509; 36 -1.905,-8.509; 37 -0.635,-8.509; 38 0.635,-8.509; 39 1.905,-8.509; 40 3.175,-8.509; 41 4.445,-8.509; 42 5.715,-8.509; 43 6.985,-8.509; 44 8.255,-8.509; 45 9.525,-8.509; 46 10.795,-8.509; 47 12.065,-8.509 | smd 2.286 x 1.016: 21 -12.954,3.81; 22 -12.954,2.54; 23 -12.954,1.27; 24 -12.954,0; 27 -12.954,-3.81; 48 12.954,5.08; 49 12.954,1.27 | smd 1.524 x 1.016: 25 -12.573,-1.27; 26 -12.573,-2.54

### Placement (x,y rotation side)
3.3_LED  97.79,41.91 270 top
5_LED  99.06,58.42 270 top
ANT  7.62,38.1 180 top
C4L  16.51,5.08 270 top
C4R  67.31,5.08 270 top
C5  69.85,68.58 180 top
C5L  17.78,22.86 90 top
C5R  68.58,22.86 90 top
C6  29.21,64.77 0 top
C7  81.28,44.45 180 top
C8  20.32,48.26 270 bottom
C9  10.16,60.96 90 bottom
C10  19.05,67.31 180 bottom
C11  89.28,53.47 90 top
C12  89.28,68.83 90 top
C13  94.11,46.48 180 top
C14  90.17,60.96 180 top
CAM  80.01,40.64 0 top
D1  86.49,46.74 0 top
D2  81.66,61.98 0 top
IC1L  25.4,13.97 0 top
IC1R  76.2,13.97 0 top
IC5  96.9,68.58 270 top
IC33  96.9,53.21 270 top
JP1  5.08,76.2 0 top
JP2  96.52,76.2 90 top
JP3L  6.35,12.7 90 top
JP3R  95.25,12.7 90 top
JP8  5.08,5.08 0 top
JP9  96.52,5.08 0 top
L1  81.28,53.34 180 top
L2  81.28,68.58 0 top
MDC1  46.99,50.8 270 bottom
MDC2  50.8,46.99 180 bottom
MDC3  54.61,49.53 270 bottom
MDC4  53.34,54.61 180 bottom
MDC5  48.26,54.61 180 bottom
MDC6  46.99,46.99 180 bottom
PAD  83.82,33.02 180 top
PIC1  50.8,50.8 0 top
PROG  27.94,46.99 270 top
PWR12  68.58,77.47 0 top
PWR_SW  77.47,77.47 0 top
Q1  58.42,36.83 90 top
R1  20.32,31.75 180 bottom
R1L  26.67,5.08 90 top
R1R  77.47,5.08 90 top
R2  20.32,34.29 180 bottom
R2L  26.67,22.86 270 top
R2R  77.47,22.86 270 top
R3  29.21,67.31 0 top
R3L  19.05,5.08 90 top
R3R  69.85,5.08 90 top
R4  57.78,45.72 0 top
R4L  20.32,22.86 270 top
R4R  71.12,22.86 270 top
R5  28.32,60.96 270 top
R5L  13.97,5.08 90 top
R5R  64.77,5.08 90 top
R9_3.3  93.98,41.91 180 top
R9_5  95.25,58.42 180 top
R10L  33.02,22.86 90 top
R10R  83.82,22.86 90 top
R11L  21.59,5.08 270 top
R11R  72.39,5.08 270 top
R12L  15.24,22.86 90 top
R12R  66.04,22.86 90 top
R13L  30.48,22.86 270 top
R13R  81.28,22.86 270 top
R14L  33.02,5.08 270 top
R14R  83.82,5.08 270 top
R15L  22.86,22.86 90 top
R15R  73.66,22.86 90 top
R16L  12.7,8.89 270 top
R16R  63.5,8.89 270 top
R17L  12.7,22.86 270 top
R17R  63.5,22.86 270 top
RST_SW  33.02,66.04 0 top
SW1  20.32,33.02 90 top
TP1L  13.97,12.7 0 top
TP1R  64.77,12.7 0 top
U$2  33.02,59.69 270 top
U$3  35.56,33.02 0 top
U$4  68.58,41.91 90 top
U$5  59.69,68.58 180 top
WIFI  15.24,55.88 90 top

### Tracks (layer width: path | path; a pad name or v marks a point on that pad's centre or on a via)
3.3V  (via drill 0.5, 0.6, 0.7, 0.9, 1.1, 1.3)
  Top 0.254: 37.85,51.05 PIC1.8 46.74,51.05 v48.26,49.53 v46.99,48.26 48.05,47.2 PIC1.19 48.05,43.6 46.99,42.55 42.55,42.55 36.83,36.83 36.83,34.29 U$3.3 | 49.02,62.74 49.05,62.71 PIC1.60 49.05,55.4 v46.99,53.34 49.02,55.37 49.02,62.74 | PIC1.54 52.05,57.13 52.07,57.15 52.07,62.23 | 52.07,62.23 54.61,64.77 U$5.6 | v54.61,53.34 53.34,53.34 52.07,54.61 52.07,56.48 PIC1.54 | v53.34,48.26 55.13,50.05 PIC1.39 62.98,50.05 64.77,48.26 67.31,48.26 U$4.7 69.85,49.53 | U$2.8 36.83,52.07 37.85,51.05 | 37.85,51.05 46.74,51.05 | v53.34,48.26 v52.07,48.26 51.55,47.74 PIC1.26 51.55,42.66 45.72,36.83 U$3.10 | U$4.2 64.77,41.91 59.13,47.55 PIC1.34 54.05,47.55 v53.34,48.26 | PIC1.54 52.05,62.21 52.07,62.23 | 54.61,66.8 53.34,68.07 53.34,74.68 | 49.02,62.74 46.99,64.77 U$5.12 46.99,66.8 45.72,68.07 45.72,74.68
  Top 0.305: U$5.6 54.61,66.8 | 53.85,74.68 53.34,74.68 | 53.34,74.68 52.83,74.68 | 46.23,74.68 45.72,74.68 | 45.72,74.68 45.21,74.68 | 69.85,49.53 71.12,50.8 71.12,65.28 | 71.12,66.04 71.12,65.28 | 71.12,65.28 70.61,65.79 71.63,65.79 | 71.88,65.79 71.63,65.79 | 71.63,65.79 71.12,65.28 | 45.72,74.93 45.72,74.68 | 53.34,74.93 53.34,74.68
  Top 0.406: v26.67,50.8 26.04,51.44 WIFI.34
  Top 0.61: IC1L.14 31.11,20.45 31.88,21.21 31.88,23.5 | 82.55,21.08 82.68,21.21 82.68,23.24 82.95,23.51 R10R.2 85.71,23.51 86.36,22.86 86.36,5.08 85.71,4.43 R14R.2 83.82,3.81 82.55,2.54 72.39,2.54 | IC1R.14 81.92,20.45 82.55,21.08 | R16L.1 10.12,9.74 9.91,9.53 9.91,2.79 10.16,2.54 21.59,2.54 | 21.59,2.54 31.75,2.54 33.02,3.81 R14L.2 34.91,4.43 35.56,5.08 v35.56,27.94 | R11L.2 21.59,2.54 | R16R.1 60.54,9.74 59.69,8.89 59.69,3.81 60.96,2.54 72.39,2.54 | 31.88,23.5 32.26,23.5 32.27,23.51 R10L.2 31.89,23.51 31.88,23.5 | 66.04,24.13 R12R.2 v66.04,27.94 | 82.55,21.08 82.55,26.67 81.28,27.94 v76.2,27.94 74.93,27.94 73.66,26.67 R15R.2 | IC33.3 v91.31,52.58 | v91.31,48.01 91.31,46.48 C13.+ 91.44,46.22 91.44,44.45 93.33,42.56 R9_3.3.2 | R11R.2 72.39,2.54 | v15.24,27.94 R12L.2 | R15L.2 v22.86,27.94 | 31.88,23.5 31.88,27.81 v31.75,27.94 | R3.2 29.84,67.33 v29.84,69.34 | v30.48,59.69 v30.48,50.8
  Top 0.813: R3.2 29.86,74.92 29.84,74.93
  Top 1.016: 76.2,53.34 76.2,66.04 71.12,66.04 66.04,66.04 64.77,67.31 64.77,73.66 63.5,74.93 53.34,74.93 45.72,74.93 29.84,74.93 16.51,74.93 13.97,72.39 WIFI.49 v13.97,67.31 13.97,57.15 13.34,56.52 v10.16,56.52 WIFI.10 | 76.2,53.34 v76.2,27.94 | L1.2 76.2,53.34 | WIFI.34 20.95,51.44 v20.32,50.8
  Bottom 0.254: MDC1.2 46.99,49.53 v48.26,49.53 | MDC5.1 46.99,54.61 v46.99,53.34 | MDC4.2 54.61,54.19 v54.61,53.34 | v53.34,48.26 54.61,48.26 MDC3.2 | MDC2.2 52.07,46.99 v52.07,48.26 | v46.99,48.26 46.48,48.26 46.35,48.13 46.35,47.2 MDC6.1
  Bottom 0.406: U$2.8 34.29,50.8 v30.48,50.8 | v30.48,50.8 v26.67,50.8 | PROG.2 29.21,44.45 30.48,45.72 v30.48,50.8
  Bottom 0.61: R2.2 R1.2 20.97,28.56 21.59,27.94 | v91.31,48.01 v91.31,52.58 88.14,52.58 86.36,50.8 78.74,50.8 78.74,53.3 L1.2 | v29.84,69.34 29.84,60.33 v30.48,59.69
  Bottom 1.016: v13.97,67.31 C10.1 | C9.1 v10.16,56.52 | v20.32,50.8 C8.1
  Bottom 1.27: v76.2,27.94 v66.04,27.94 v35.56,27.94 v31.75,27.94 v22.86,27.94 21.59,27.94 v15.24,27.94
5V  (via drill 0.6, 0.7)
  Top 0.61: IC5.3 v91.31,67.94 | C14.+ 87.63,60.96 v87.63,63.5 | R9_5.2 87.63,58.42
  Top 1.016: 87.63,60.96 87.63,58.42 81.28,58.42 80.43,57.57 C7.2 80.43,41.19 CAM.1 80.01,35.56 81.28,34.29 PAD.2
  Bottom 0.61: v91.31,67.94 87.63,67.94 | 87.63,67.94 84.42,67.94 L2.2 | v87.63,63.5 87.63,67.94
12V  (via drill 0.7, 1.1)
  Top 0.61: IC1L.5 IC1L.20 23.5,19.68 v22.86,20.32 | IC1R.5 IC1R.20 74.3,19.68 v73.66,20.32 | IC5.1 89.28,70.48 C12.+ | IC33.1 89.28,55.12 C11.+
  Top 1.016: C11.+ 89.28,56.77 v96.52,56.77 | v96.52,71.88 89.79,71.88 89.28,72.39
  Top 1.27: PWR_SW.2 88.14,77.47 89.28,76.33 89.28,72.39 C12.+
  Bottom 0.61: v22.86,20.32 v73.66,20.32
  Bottom 0.813: v73.66,20.32 78.74,25.4
  Bottom 1.016: v96.52,71.88 v96.52,56.77 96.52,26.67 95.25,25.4 78.74,25.4
!MCLR
  Top 0.254: PIC1.9 37.08,50.55 36.83,50.8 34.29,50.8 U$2.9
  Top 0.406: 29.21,49.53 U$2.9 | 29.21,49.53 27.94,48.26 PROG.1 | R5.2 28.32,59.44 28.83,58.93 28.83,49.91 29.21,49.53
A44
  Top 0.406: 28.56,66.04 28.56,64.77 C6.1 28.32,64.73 R5.1 | 28.56,66.04 R3.1 | RST_SW.1 29.21,66.04 | 29.21,66.04 28.56,66.04 | 28.57,66.67 29.21,66.04 | 28.57,65.41 29.21,66.04
D+
  Top 0.254: PIC1.37 61.44,49.05 64.77,45.72 67.31,45.72 U$4.5
D-
  Top 0.254: PIC1.36 60.67,48.55 64.77,44.45 U$4.4
ENABLEL
  Top 0.61: R13L.2 30.48,21.08 29.84,20.45 IC1L.15
ENABLER
  Top 0.61: R13R.2 81.28,21.08 80.64,20.45 IC1R.15
GND  (via drill 0.5, 0.6, 1.1)
  Top 0.254: U$2.7 34.29,53.34 36.83,53.34 38.62,51.55 PIC1.7 47.74,51.55 v48.26,52.07 v49.53,53.34 49.53,55.88 49.55,55.9 PIC1.59 49.55,63.48 48.26,64.77 48.26,67.31 U$5.11 | U$5.7 53.34,67.31 53.34,64.77 51.55,62.98 PIC1.55 51.55,53.86 v52.07,53.34 | U$4.8 64.77,49.53 63.75,50.55 PIC1.40 53.59,50.55 v53.34,50.8 | PIC1.35 59.9,48.05 64.77,43.18 67.31,43.18 U$4.3 | v49.53,48.26 51.05,46.74 PIC1.25 51.05,42.8 46.99,38.73 46.35,38.73 44.45,36.83 44.45,34.29 U$3.9 | v48.26,48.26 48.55,47.97 PIC1.20 48.55,43.47 46.99,41.91 43.18,41.91 38.1,36.83 U$3.4 | R4.1 v55.88,45.72
  Top 0.305: v53.34,50.8 52.07,52.07 v52.07,53.34
  Top 0.406: C6.2 34.29,64.77 RST_SW.2
  Top 0.61: R5R.1 C4R.2 R3R.1 69.85,4.45 v71.12,4.45 | R5L.1 C4L.2 R3L.1 19.07,4.45 v20.32,4.45 | R13L.1 26.87,23.51 | R13R.1 77.67,23.51 | 77.67,23.51 R2R.1 77.47,24.13 v76.2,25.4 | R4L.1 C5L.2 v17.78,25.4 | C5R.2 R4R.1 v71.12,25.4 | R17R.1 63.48,23.5 v60.58,23.5 | 77.67,23.51 77.66,23.5 76.07,23.5 75.56,22.99 IC1R.19 IC1R.6 75.56,8.26 74.93,7.62 v74.93,3.81 | 26.87,23.51 26.86,23.5 | R17L.1 v12.7,25.4 | IC33.5 IC33.4 89.28,51.31 C11.- 89.17,51.07 88.9,50.8 88.9,47.15 D1.A | IC5.5 IC5.4 89.28,66.67 C12.- 84.21,66.43 83.82,66.04 83.82,62.13 D2.A | 3.3_LED.C 98.55,41.92 98.55,46.48 | 5_LED.C 99.97,58.58 99.97,59.69 | IC1R.7 v76.83,16.51 IC1R.18 | v24.64,4.19 24.77,4.32 IC1L.6 IC1L.19 | IC1L.18 v26.04,16.76 IC1L.7 | v26.67,25.4 R2L.1 26.87,23.61 26.87,23.51
  Top 1.016: CAM.4 87.63,41.91 86.36,43.18 | 86.36,43.18 85.09,44.45 C7.1 | D1.A 88.49,45.31 86.36,43.18 | WIFI.47 24.13,67.94 v24.13,71.12 | WIFI.1 6.35,67.94 v6.35,71.12 | WIFI.39 v20.95,57.78 | WIFI.22 WIFI.23 | WIFI.26 19.05,43.31 WIFI.27 19.05,43.81 WIFI.28 | WIFI.25 WIFI.26 | WIFI.26 v17.78,45.72 | WIFI.14 v10.29,51.44 | WIFI.21 WIFI.22 | WIFI.22 v12.7,45.72 | WIFI.20 v4.06,43.81 | R1R.1 77.47,3.81 v74.93,3.81 | R1L.1 26.67,4.19 v24.64,4.19
  Top 1.27: IC5.8 IC5.7 IC5.6 IC5.5 99.97,60.96 | 99.97,60.96 99.97,59.69 IC33.8 IC33.7 IC33.6 IC33.5 99.97,47.78 98.68,46.48 98.55,46.48 C13.- | C14.- 99.97,60.96
  Bottom 0.254: MDC1.1 47.41,52.07 v48.26,52.07 | MDC5.2 49.53,54.61 v49.53,53.34 | MDC4.1 52.07,54.61 v52.07,53.34 | MDC3.1 54.61,50.8 v53.34,50.8 | MDC2.1 49.53,46.99 v49.53,48.26 v48.26,48.26 48.26,47.41 MDC6.2 | v55.88,45.72 59.05,45.72 60.64,47.31 64.77,43.18 67.31,43.18 U$4.3
  Bottom 0.406: PROG.3 29.46,41.91 31.24,43.69
  Bottom 0.61: v12.7,25.4 v17.78,25.4 | v71.12,4.45 71.12,5.08 | v76.83,16.51 77.72,16.51 | v20.32,4.45 20.32,3.81 | v26.04,16.76 26.42,16.76 26.67,16.51 | v71.12,25.4 v76.2,25.4 | v26.67,25.4 27.94,25.4
  Bottom 1.016: v24.13,71.12 24.13,72.39 | v6.35,71.12 7.62,71.12 | v20.95,57.78 19.05,57.78 19.05,58.42 | v17.78,45.72 17.78,46.99 | v10.29,51.44 11.43,51.44 11.43,52.07 | v12.7,45.72 12.7,46.99 | v4.06,43.81 3.81,43.81 3.81,44.45 | v74.93,3.81 74.93,5.08 | v24.64,4.19 24.64,5.33 24.77,5.46
  pour Bottom (isolate 0.508): 0,81.28 101.6,81.28 101.6,0 0,0 0,31.75 13.97,31.75 13.97,43.18 0,43.18
MS1L
  Top 0.61: IC1L.12 32.38,8.26 33.02,7.62 R14L.1
MS1R
  Top 0.61: IC1R.12 83.19,8.26 83.82,7.62 R14R.1
MS2L
  Top 0.61: R10L.1 33.02,21.08 32.38,20.45 IC1L.13
MS2R
  Top 0.61: R10R.1 83.82,21.08 83.19,20.45 IC1R.13
N$1
  Top 0.61: IC1L.8 27.3,8.26 26.67,7.62 R1L.2
N$2
  Top 0.61: R9_3.3.1 3.3_LED.A
N$3
  Top 0.61: IC1L.17 27.3,19.68 26.67,20.32 R2L.2
N$5
  Top 0.61: C4L.1 R3L.2 19.05,6.86 19.68,7.49 IC1L.2
N$6
  Top 0.254: PIC1.31 54.05,42.47 55.88,40.64 55.88,39.37 58.42,36.83 Q1.1
N$7
  Top 0.61: C5L.1 R4L.2 20.32,21.08 19.68,20.45 IC1L.23
N$8
  Top 0.61: IC1R.8 78.11,8.26 77.47,7.62 R1R.2
N$9
  Top 0.61: IC1R.17 78.11,19.68 77.47,20.32 R2R.2
N$10
  Top 0.61: C4R.1 R3R.2 69.85,6.99 70.48,7.62 IC1R.2
N$11
  Top 0.61: R5L.2 12.18,5.73 11.3,6.6 11.3,7.99 R16L.3
N$12
  Top 0.61: TP1L.1 14.15,12.52 R16L.2 18.29,8.89 18.41,8.76 IC1L.1
N$13
  Top 0.61: C5R.1 R4R.2 71.12,21.08 70.48,20.45 IC1R.23
N$14
  Top 0.61: R16R.2 64.95,12.52 TP1R.1 | R16R.2 64.77,8.89 | R16R.2 69.22,8.89 IC1R.1
N$15
  Top 0.254: PIC1.32 54.61,45.1 54.61,43.18 55.88,41.91 58.17,41.91 Q1.2
N$16
  Top 0.61: R5R.2 62.85,5.73 62.1,6.48 62.1,7.99 R16R.3
N$17
  Top 0.61: 5_LED.A R9_5.1
N$18
  Top 0.813: WIFI.24 15.24,39.37 13.97,38.1 ANT.P$1
N$19
  Top 1.27: C5.1 67.31,76.2 PWR12.1
  Bottom 1.27: PWR12.1 68.58,78.74 69.85,80.01 74.93,80.01 PWR_SW.1
N$23
  Top 0.254: 28.45,65.53 27.94,65.02
N$24
  Top 0.254: 27.94,64.26 28.19,64.01 28.19,64.26
N$25
  Top 0.254: 27.94,65.28 28.19,65.53
N$40  (via drill 0.6)
  Top 0.61: IC33.2 v91.31,53.85 | D1.C 84.49,52.63 L1.1
  Bottom 0.61: v91.31,53.85 84.29,53.85 L1.1
N$45  (via drill 0.6)
  Top 0.61: IC5.2 v91.31,69.22 | D2.C 79.66,67.7 L2.1
  Bottom 0.61: v91.31,69.22 85.72,69.22 85.09,69.85 80.01,69.85 78.78,68.62 L2.1
OUT1AL  (via drill 0.6)
  Top 0.61: IC1L.16 28.57,15.88 v27.94,15.24
  Bottom 0.61: v27.94,15.24 16.51,15.24 13.97,17.78 JP3L.3
OUT1AR  (via drill 0.6)
  Top 0.61: IC1R.16 79.38,17.14 v80.01,16.51
  Bottom 0.61: v80.01,16.51 91.44,16.51 92.71,17.78 JP3R.3
OUT1BL
  Top 0.61: IC1L.21 22.23,17.14 21.59,16.51 17.78,16.51 13.97,20.32 JP3L.4
OUT1BR  (via drill 0.6)
  Top 0.61: IC1R.21 v73.03,15.24 | v90.17,15.24 v90.17,20.32
  Bottom 0.61: v73.03,15.24 v90.17,15.24 | v90.17,20.32 JP3R.4
OUT2AL  (via drill 0.6)
  Top 0.61: IC1L.9 28.57,12.06 v27.94,12.7
  Bottom 0.61: v27.94,12.7 19.05,12.7 16.51,10.16 12.7,10.16 10.16,12.7 JP3L.1
OUT2AR  (via drill 0.6)
  Top 0.61: IC1R.9 79.38,12.06 v80.01,12.7
  Bottom 0.61: v80.01,12.7 JP3R.1
OUT2BL
  Top 0.61: IC1L.4 22.23,13.34 21.59,13.97 15.24,13.97 13.97,15.24 JP3L.2
OUT2BR  (via drill 0.6)
  Top 0.61: IC1R.4 v73.03,13.97
  Bottom 0.61: v73.03,13.97 91.44,13.97 92.71,15.24 JP3R.2
PFDL
  Top 0.61: R17L.2 R12L.1 15.24,21.59 16.51,20.32 17.78,20.32 18.41,19.68 IC1L.24
PFDR
  Top 0.61: R17R.2 R12R.1 66.04,21.59 67.31,20.32 68.58,20.32 69.22,19.68 IC1R.24
RB0
  Top 0.254: PIC1.16 41.97,47.05 36.83,41.91 U$2.16
  Top 0.406: PROG.4 33.02,39.37 U$2.16
RB1
  Top 0.254: PIC1.15 41.2,47.55 36.83,43.18 34.29,43.18 U$2.15
  Bottom 0.406: PROG.5 30.48,36.83 30.48,40.64 31.75,41.91 U$2.15
RB2
  Top 0.254: PIC1.14 40.43,48.05 36.83,44.45 U$2.14
RB3  (via drill 0.5)
  Top 0.254: PIC1.13 39.66,48.55 36.83,45.72 34.29,45.72 U$2.13
  Top 0.406: U$2.13 29.21,40.64 26.67,40.64 22.86,36.83 19.05,36.83 SW1.3
  Bottom 0.61: R2.1 SW1.3
  other vias: 16.51,34.29
RB4
  Top 0.254: PIC1.12 38.89,49.05 36.83,46.99 U$2.12 35.31,46.99 34.54,46.23 34.04,46.23 33.53,45.72 31.75,45.72
  Top 0.406: 31.75,45.72 29.21,43.18 26.67,43.18 21.59,38.1 19.05,38.1 16.51,35.56 15.24,35.56 13.97,34.29 13.97,33.02 15.24,31.75 SW1.4
  Bottom 0.61: R1.1 SW1.4
RB5
  Top 0.254: PIC1.11 38.12,49.55 36.83,48.26 34.29,48.26 U$2.11
RB6
  Top 0.254: PIC1.17 47.05,43.88 46.99,43.81 41.27,43.81 34.29,36.83 34.29,34.29 U$3.1
RB7
  Top 0.254: U$3.2 35.56,36.83 41.91,43.18 46.99,43.18 47.55,43.74 PIC1.18
RB8  (via drill 0.7)
  Top 0.254: PIC1.21 49.05,43.34 46.99,41.27 43.81,41.27 39.37,36.83 39.37,34.29 U$3.5
  Top 0.406: v40.64,11.43 U$3.5
  Top 0.61: IC1L.11 31.11,10.79 v31.75,11.43
  Bottom 0.61: v31.75,11.43 v40.64,11.43
RB9  (via drill 0.7)
  Top 0.254: PIC1.22 49.55,43.2 46.99,40.64 44.45,40.64 40.64,36.83 U$3.6
  Top 0.406: v41.91,12.7 v41.91,30.48
  Top 0.61: IC1L.10 29.84,12.06 v30.48,12.7
  Bottom 0.406: v41.91,30.48 41.91,34.29 U$3.6
  Bottom 0.61: v30.48,12.7 v41.91,12.7
RB14  (via drill 0.7)
  Top 0.254: PIC1.29 53.05,42.26 49.53,38.73 49.53,34.29 U$3.13
  Top 0.406: IC1R.10 v80.64,11.43 | v50.8,15.24 U$3.13
  Bottom 0.406: v80.64,11.43 71.12,11.43 67.31,15.24 v50.8,15.24
RB15  (via drill 0.7)
  Top 0.254: PIC1.30 53.55,42.12 50.8,39.37 U$3.14
  Top 0.406: IC1R.22 71.75,17.14 v71.12,16.51 | v52.07,16.51 52.07,34.29 U$3.14
  Top 0.61: R15R.1 73.64,22.23 72.77,22.23 72.14,21.59 72.14,20.7 71.75,20.32 IC1R.22
  Bottom 0.406: v71.12,16.51 v52.07,16.51
RC13
  Top 0.254: PIC1.47 60.4,54.05 64.77,58.42 67.31,58.42 U$4.15
RC14
  Top 0.254: PIC1.48 59.63,54.55 64.77,59.69 U$4.16
RD0  (via drill 0.7)
  Top 0.254: PIC1.46 61.17,53.55 64.77,57.15 U$4.14
  Top 0.406: v73.66,58.42 v73.66,36.83 | v85.09,36.83 CAM.3
  Bottom 0.406: U$4.14 67.31,58.42 v73.66,58.42 | v73.66,36.83 v85.09,36.83
RD1
  Top 0.254: PIC1.49 54.55,58.36 60.96,64.77 60.96,67.31 U$5.1
RD2
  Top 0.254: PIC1.50 54.05,59.13 59.69,64.77 U$5.2
RD3
  Top 0.254: PIC1.51 53.55,59.9 58.42,64.77 58.42,67.31 U$5.3
RD4
  Top 0.254: PIC1.52 53.05,60.67 57.15,64.77 U$5.4
RD5
  Top 0.254: PIC1.53 52.55,61.44 55.88,64.77 55.88,67.31 U$5.5
RD9  (via drill 0.5)
  Top 0.254: PIC1.43 63.48,52.05 64.77,53.34 67.31,53.34 U$4.11
  Top 0.406: v72.39,54.61 v72.39,38.1 | v82.55,38.1 CAM.2
  Bottom 0.406: U$4.11 v72.39,54.61 | v72.39,38.1 v82.55,38.1
RD10
  Top 0.254: PIC1.44 62.71,52.55 64.77,54.61 U$4.12
RD11
  Top 0.254: PIC1.45 61.94,53.05 64.77,55.88 67.31,55.88 U$4.13
RE0
  Top 0.254: PIC1.58 50.05,64.25 49.53,64.77 U$5.10
RE1
  Top 0.254: PIC1.61 48.55,61.94 45.72,64.77 45.72,67.31 U$5.13
RE2
  Top 0.254: PIC1.62 48.05,61.17 44.45,64.77 U$5.14
RE3
  Top 0.254: PIC1.63 47.55,60.4 43.18,64.77 43.18,67.31 U$5.15
RE4
  Top 0.254: PIC1.64 47.05,59.63 41.91,64.77 U$5.16
RE5
  Top 0.254: PIC1.1 43.24,54.55 36.83,60.96 34.29,60.96 U$2.1
RE6
  Top 0.254: PIC1.2 42.47,54.05 36.83,59.69 U$2.2
RE7
  Top 0.254: PIC1.3 41.7,53.55 36.83,58.42 34.29,58.42 U$2.3
RF0
  Top 0.254: PIC1.56 51.05,63.75 52.07,64.77 U$5.8
RF1
  Top 0.254: PIC1.57 50.55,64.52 50.8,64.77 50.8,67.31 U$5.9
RF3  (via drill 0.5)
  Top 0.254: PIC1.38 62.21,49.55 64.77,46.99 U$4.6
  Top 0.406: v77.47,46.99 77.47,34.29 PAD.3
  Bottom 0.406: v77.47,46.99 76.2,48.26 67.31,48.26 U$4.6
RF4
  Top 0.254: PIC1.41 64.52,51.05 64.77,50.8 67.31,50.8 U$4.9
RF5
  Top 0.254: PIC1.42 64.25,51.55 64.77,52.07 U$4.10
RG6  (via drill 0.5)
  Top 0.254: PIC1.4 40.93,53.05 36.83,57.15 U$2.4
  Top 0.406: WIFI.40 25.27,59.05 25.53,58.8 25.53,58.29 26.16,57.66 v26.16,56.64
  Bottom 0.406: v26.16,56.64 30.99,56.64 31.75,55.88 34.29,55.88 U$2.4
RG7  (via drill 0.5)
  Top 0.254: PIC1.5 40.16,52.55 36.83,55.88 34.29,55.88 U$2.5
  Top 0.406: WIFI.45 25.91,65.41 26.29,65.02 26.29,58.8 27.05,58.04 v27.05,55.5
  Bottom 0.406: v27.05,55.5 30.86,55.5 31.75,54.61 U$2.5
RG8  (via drill 0.5)
  Top 0.254: PIC1.6 39.39,52.05 36.83,54.61 U$2.6
  Top 0.406: WIFI.46 26.04,66.67 27.18,65.53 27.18,59.18 27.94,58.42 v27.94,54.61
  Bottom 0.406: v27.94,54.61 30.48,54.61 31.75,53.34 34.29,53.34 U$2.6
RG9
  Top 0.254: PIC1.10 37.35,50.05 36.83,49.53 U$2.10
SLEEPL
  Top 0.61: IC1L.3 20.95,6.99 21.59,6.35 R11L.1
SLEEPR
  Top 0.61: IC1R.3 71.75,6.99 72.39,6.35 R11R.1
TCK
  Top 0.254: PIC1.27 52.05,42.52 46.99,37.47 46.99,34.29 U$3.11
TDD
  Top 0.254: PIC1.24 50.55,42.93 46.99,39.37 45.72,39.37 43.18,36.83 U$3.8
TDI  (via drill 0.7)
  Top 0.254: PIC1.28 52.55,42.39 48.26,38.1 U$3.12
  Top 0.406: IC1R.11 81.92,6.99 v81.28,6.35 | v49.53,6.35 v49.53,30.48
  Bottom 0.406: v81.28,6.35 v49.53,6.35 | v49.53,30.48 49.53,34.29 U$3.12
TMS  (via drill 0.7)
  Top 0.254: PIC1.23 50.05,43.06 46.99,40.01 45.09,40.01 41.91,36.83 41.91,34.29 U$3.7
  Top 0.406: IC1L.22 20.95,20.32 21.59,20.95 v21.59,21.59 21.59,21.84 21.96,22.21 | 21.96,22.21 21.97,22.23 22.84,22.23 R15L.1 21.96,22.21 | v43.18,21.59 U$3.7
  Bottom 0.406: v21.59,21.59 v43.18,21.59
VBUS
  Top 0.254: PIC1.33 58.36,47.05 59.37,46.04 | 59.37,46.04 64.77,40.64 67.31,40.64 U$4.1 | R4.2 59.05,45.72 59.37,46.04
(copper drawn outside any net)
  shapes: Top area x2

### Text on the board
_tsilk: Team 1--Nathan Tornquist--Mark Harlan--TJ Root--Josh Hannan | Twitch Plays ECE 477--RobotBoard v2.0 | WiFi | 49 | 1 | . | 33 | 17 | S | + | - | Left | Right